# EAGLE design ExtBoard (EAGLE 6.5.0)
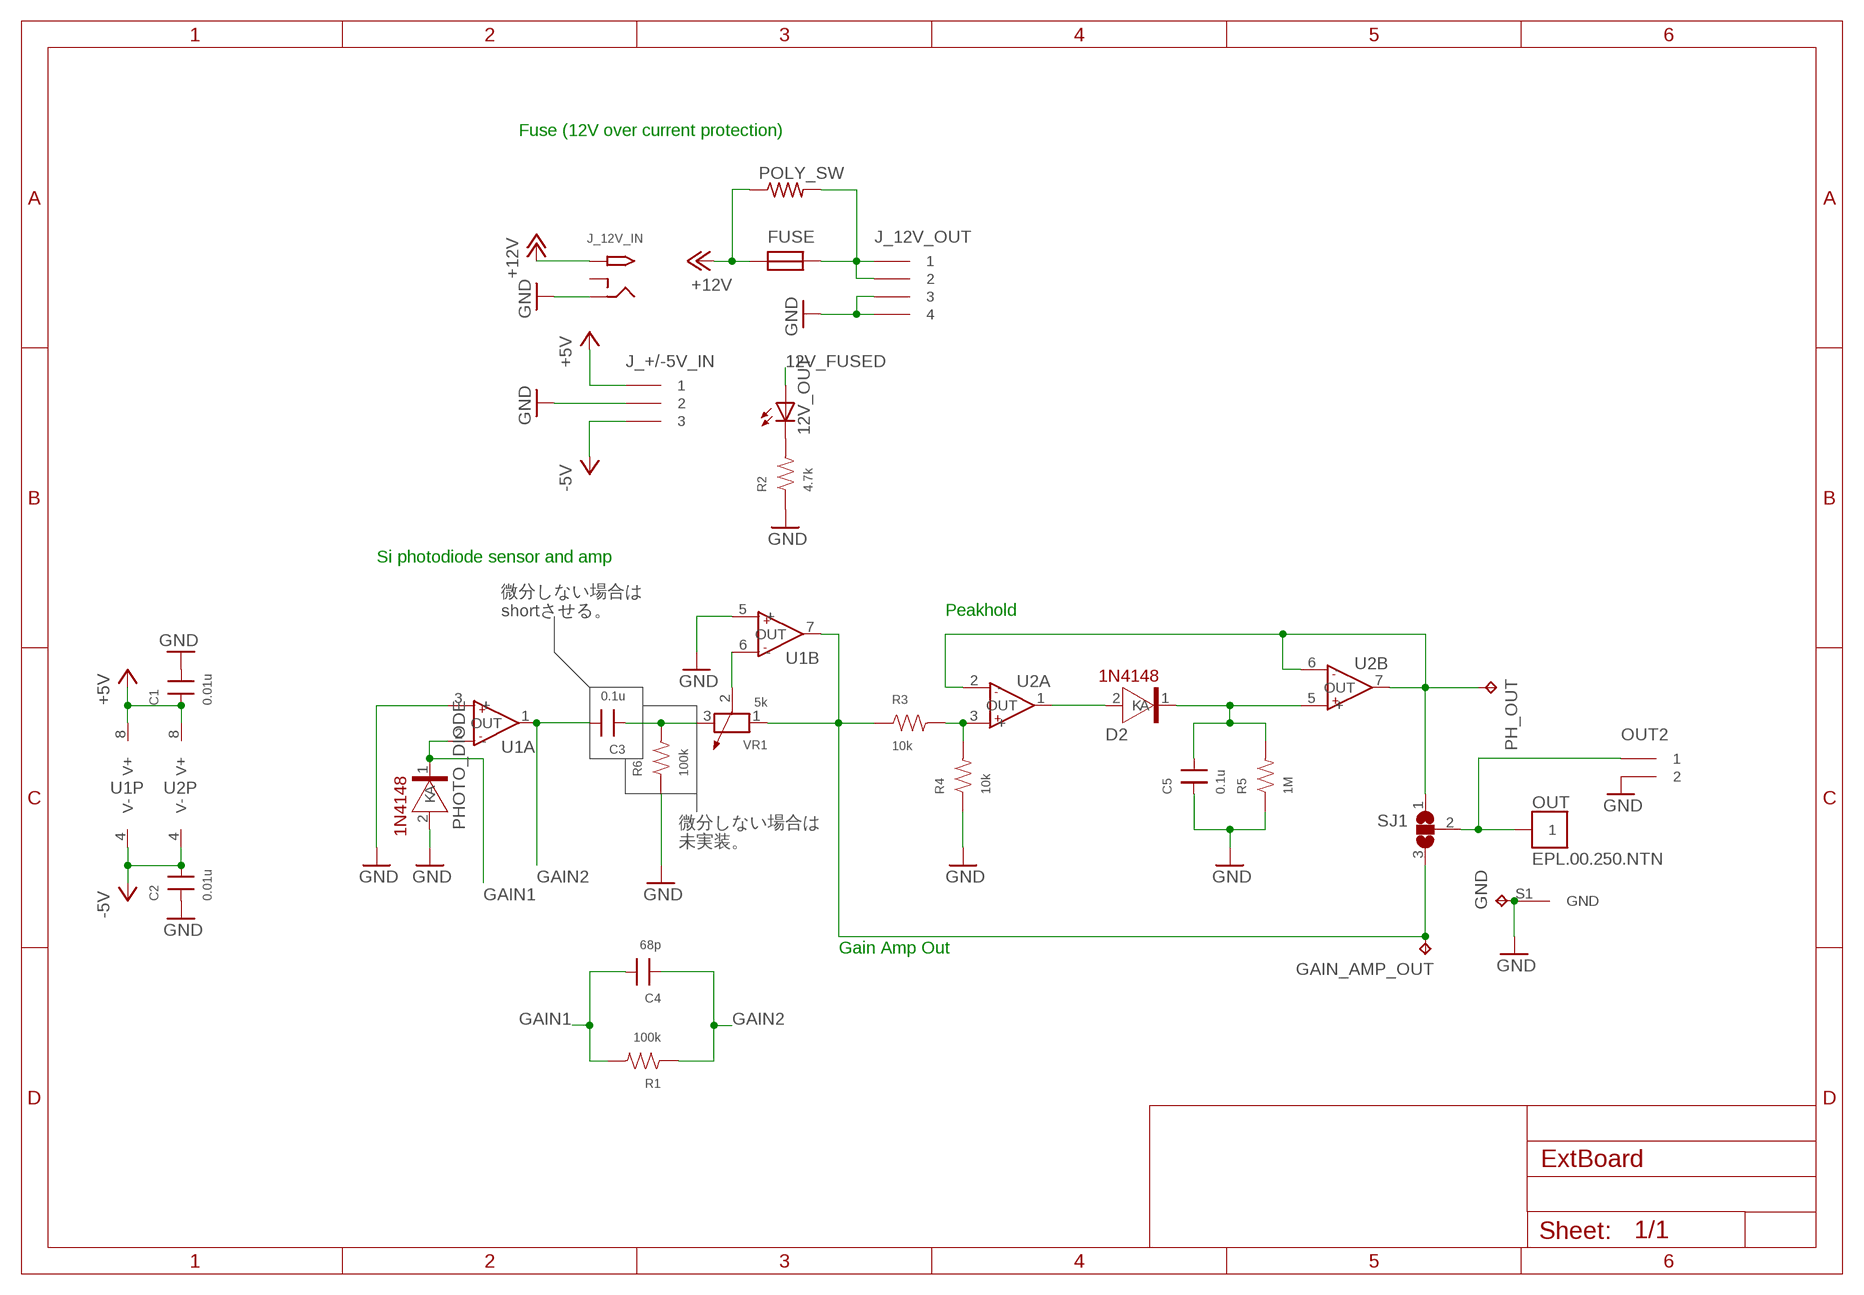
[diagram p0: schematic, sheet 1]

## Parts
12V_OUT  LED_1608  [LED_1608]
C1  0.01u  C226-3216  [3216]
C2  0.01u  C226-3216  [3216]
C3  0.1u  C226-3216  [3216]
C4  68p  C226-3216  [3216]
C5  0.1u  C226-3216  [3216]
D2  1N4148  [4020-2P]
FUSE  FUSE_LITTLEFUSE_649  [LITTLEFUSE_649]
GAIN_AMP_OUT  TPPAD1-13  [P1-13]
GND  TPPAD1-13  [P1-13]
J_12V_IN  2.1MMJACKTHM  [PJ-102A]
J_12V_OUT  IL-4P-S3EN2  [IL-4P-S3EN2]
J_+/-5V_IN  IL-3P-S3EN2  [IL-3P-S3EN2]
OUT  EPL.00.250.NTN  [EPL.00.250.NTN]
OUT2  IL-2P-S3EN2  [IL-2P-S3EN2]
PH_OUT  TPPAD1-13  [P1-13]
PHOTO_DIODE  1N4148  [4020-2P]
POLY_SW  R-US_0207/10  [0207/10]
R1  100k  R2012  [2012]
R2  4.7k  R2012  [2012]
R3  10k  R2012  [2012]
R4  10k  R2012  [2012]
R5  1M  R2012  [2012]
R6  100k  R2012  [2012]
SJ1  SJ2WW  [SJ_2W]
U1  LM6172SOIC(D)8  [SOP8]
U2  LM6172SOIC(D)8  [SOP8]
VR1  5k  DIP-TRIMMER-10K-10%-1/2W(3P-9.7X5.0X9.80MM)  [ADJRP3-9.70XW5.0X9.80MM]

## Nets
12V_FUSED [power]: 12V_OUT.P$1(A) FUSE.P$2 J_12V_OUT.P$1 J_12V_OUT.P$2 POLY_SW.2
+5V: C1.1 J_+/-5V_IN.P$1 U1.8(P:V+) U2.8(P:V+)
+12V [power]: FUSE.P$1 J_12V_IN.TIP POLY_SW.1
-5V: C2.2 J_+/-5V_IN.P$3 U1.4(P:V-) U2.4(P:V-)
GAIN1: C4.2 PHOTO_DIODE.1(K) R1.2 U1.2(A:-)
GAIN2: C3.2 C4.1 R1.1 U1.1(A:OUT)
GAIN_AMP_OUT: GAIN_AMP_OUT.TP R3.1 SJ1.3 U1.7(B:OUT) VR1.1
GND [power]: C1.2 C2.1 C5.1 GND.TP J_12V_IN.RING J_12V_OUT.P$3 J_12V_OUT.P$4 J_+/-5V_IN.P$2 OUT2.P$2 OUT.S1(GND) PHOTO_DIODE.2(A) R2.1 R4.1 R5.1 R6.1 U1.3(A:+) U1.5(B:+)
N$1: OUT2.P$1 OUT.1 SJ1.2
N$3: U1.6(B:-) VR1.2
N$4: C5.2 D2.1(K) R5.2 U2.5(B:+)
N$5: R3.2 R4.2 U2.3(A:+)
N$6: D2.2(A) U2.1(A:OUT)
N$10: C3.1 R6.2 VR1.3
N$12: 12V_OUT.P$2(C) R2.2
PH_OUT: PH_OUT.TP SJ1.1 U2.2(A:-) U2.6(B:-) U2.7(B:OUT)
Unconnected: J_12V_IN.RING_SW

## Notes on the sheet
- Fuse (12V over current protection)
- Si photodiode sensor and amp
- 微分しない場合は
  shortさせる。
- Peakhold
- 微分しない場合は
  未実装。
- Gain Amp Out

## Library data of the parts
12V_OUT = Aardvark:LED_1608: SMD LED datasheet <http://docs-asia.electrocomponents.com/webdocs/1020/0900766b81020b31.pdf> -------------------------- 色: V 1608 SML-310VTT86 (Vf=2.0V I_F=20mA) RS: 700-7926 <http://jp.rs-online.com/web/p/visible-leds/7007926/> 15円/個 20個単位 -------------------------- 色: 黄色 SML-311WTT86 (Vf=1.8 I_F=2mA) RS: 752-6789 <http://jp.rs-online.com/web/p/visible-leds/7526789/> 11.5円/個 10個単位
C1-C5 = Aardvark:C226-3216: MURATA 22uF 25WV AKIDUKI P-06038 GRM31CB31E226KE15
D2 PHOTO_DIODE = Aardvark:1N4148: VISHAY 1N4148 1N4448 100V 200mA http://www.nxp.com/documents/data_sheet/1N4148_1N4448.pdf
FUSE = Aardvark:FUSE_LITTLEFUSE_649: LittleFuse 649 For 5x20mm fuse RS: 787-4164 Datasheet <http://docs-asia.electrocomponents.com/webdocs/128f/0900766b8128f4b9.pdf>
GAIN_AMP_OUT GND PH_OUT = Aardvark:TP: Test pad
J_12V_IN = Aardvark:2.1MMJACK: 2.1mm x 5.5mm THM DC jack with internal switch. Digikey part #PJ-102A, 4UCON part #05537 2.1mm x 5.5mm SMT DC jack with internal switch. Digikey part #PJ-002A-SMT, 4UCON part #03267 By microbuilder.eu & adafruit.com
J_12V_OUT = Aardvark:IL-4P-S3EN2: JAE 4pin connector (used by Shimafuji FPGA boards) http://jae-connectors.com/jp/pdf_download_exec.cfm?param=SJ015900.pdf
J_+/-5V_IN = Aardvark:IL-3P-S3EN2: JAE 3pin connector (used by Shimafuji FPGA boards) http://jae-connectors.com/jp/pdf_download_exec.cfm?param=SJ015900.pdf
OUT = Aardvark:EPL.00.250.NTN: LEMO Connector Elbow receptacle for printed circuit Source: http://intra.lemo.ch/catalog/ROW/UK_English/00and01Coaxial_en.pdf RS: Right angle: http://jp.rs-online.com/web/p/coaxial-plugs-sockets/1248635/ Straight1: http://jp.rs-online.com/web/p/coaxial-plugs-sockets/1243371/ Straight2: http://jp.rs-online.com/web/p/coaxial-plugs-sockets/1248629/; MPN: EPL.00.250.NTN; OC_FARNELL: 3817866; OC_NEWARK: 25R7486; PACKAGE: Through Hole; SUPPLIER: LEMO
OUT2 = Aardvark:IL-2P-S3EN2: JAE 2pin connector (used by Shimafuji FPGA boards) http://jae-connectors.com/jp/pdf_download_exec.cfm?param=SJ015900.pdf
POLY_SW = rcl:R-US_: RESISTOR, American symbol
R1-R6 = Aardvark:R2012: Surface Mount 2012 Type Registor
SJ1 = Aardvark:SJ2W: SMD solder JUMPER
U1 U2 = Aardvark:LM6172: TEXAS INSTRUMENTS Dual High Speed, Low Power, Low Distortion, Voltage Feedback Amplifier LM6172 <http://www.ti.com/lit/ds/symlink/lm6172.pdf>
VR1 = Aardvark:DIP-TRIMMER-10K-10%-1/2W(3P-9.7X5.0X9.80MM): T93YA502KT20 Datasheet <http://docs-asia.electrocomponents.com/webdocs/0ed9/0900766b80ed9ad6.pdf> RS Website 788-5079 <http://jp.rs-online.com/web/p/trimmer-resistors/7885079/>; MPN: T93YA103KT20

## Net classes
1 power: width 0.508 mm, clearance 0.254 mm

## Board
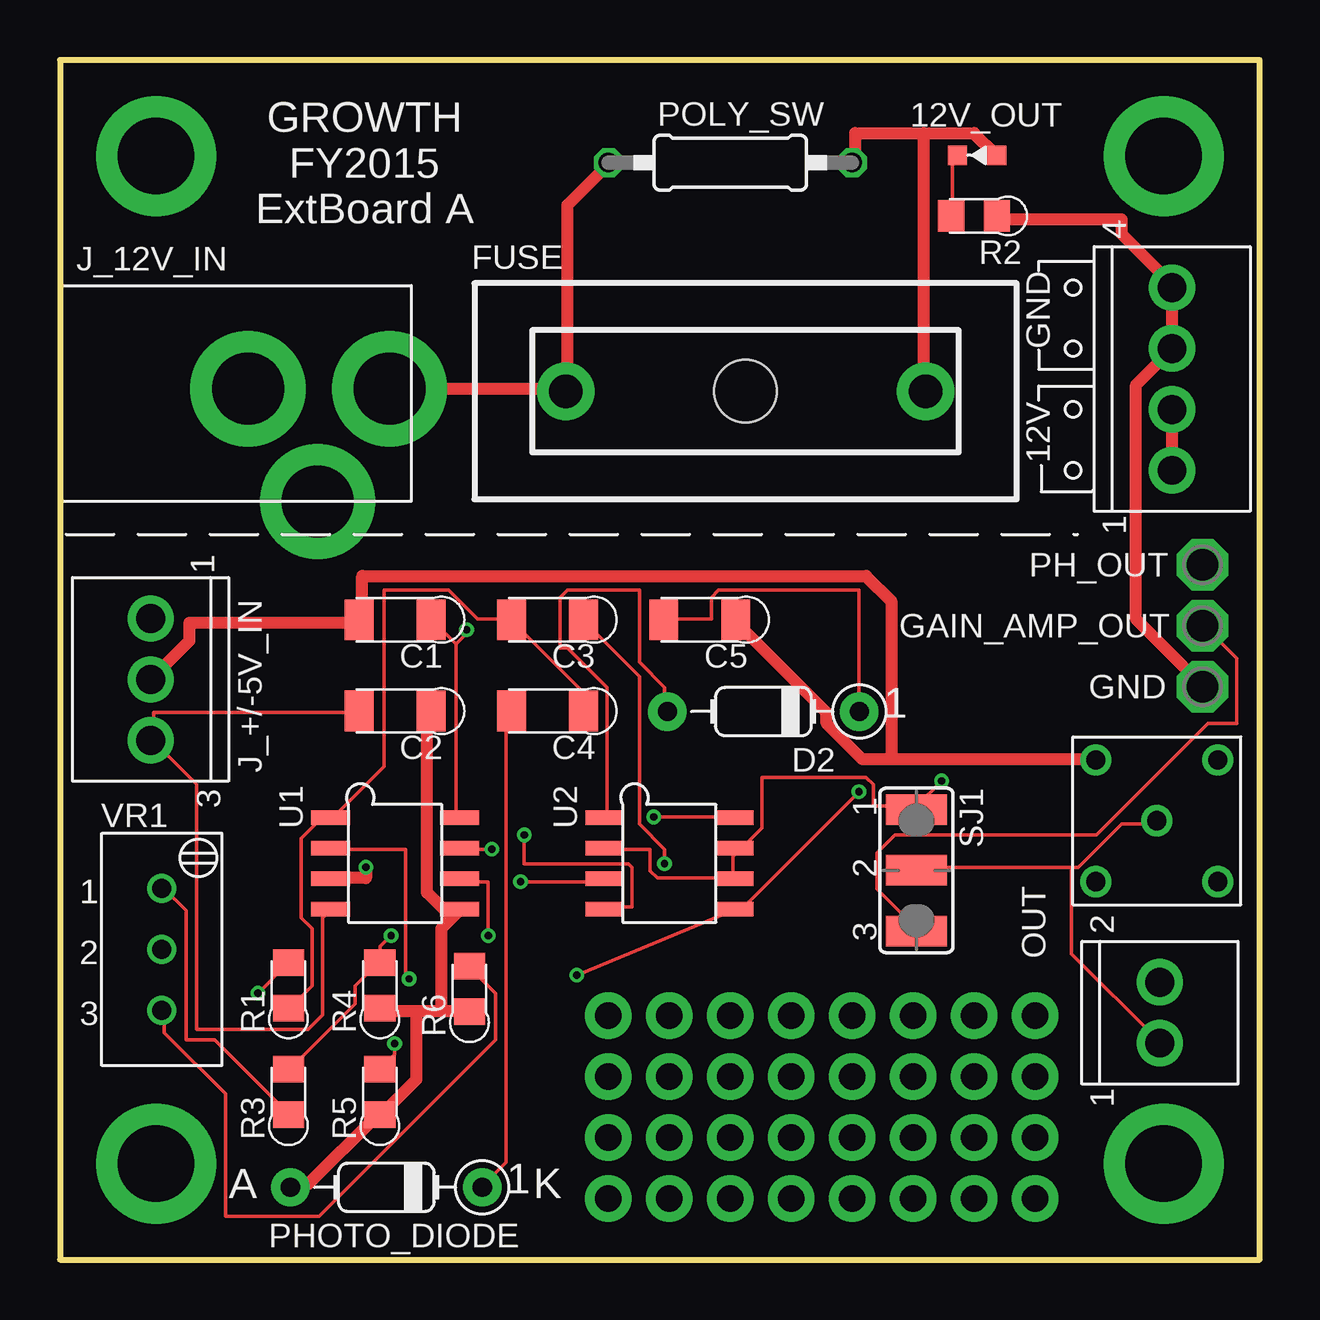
[diagram p1: board, top side]
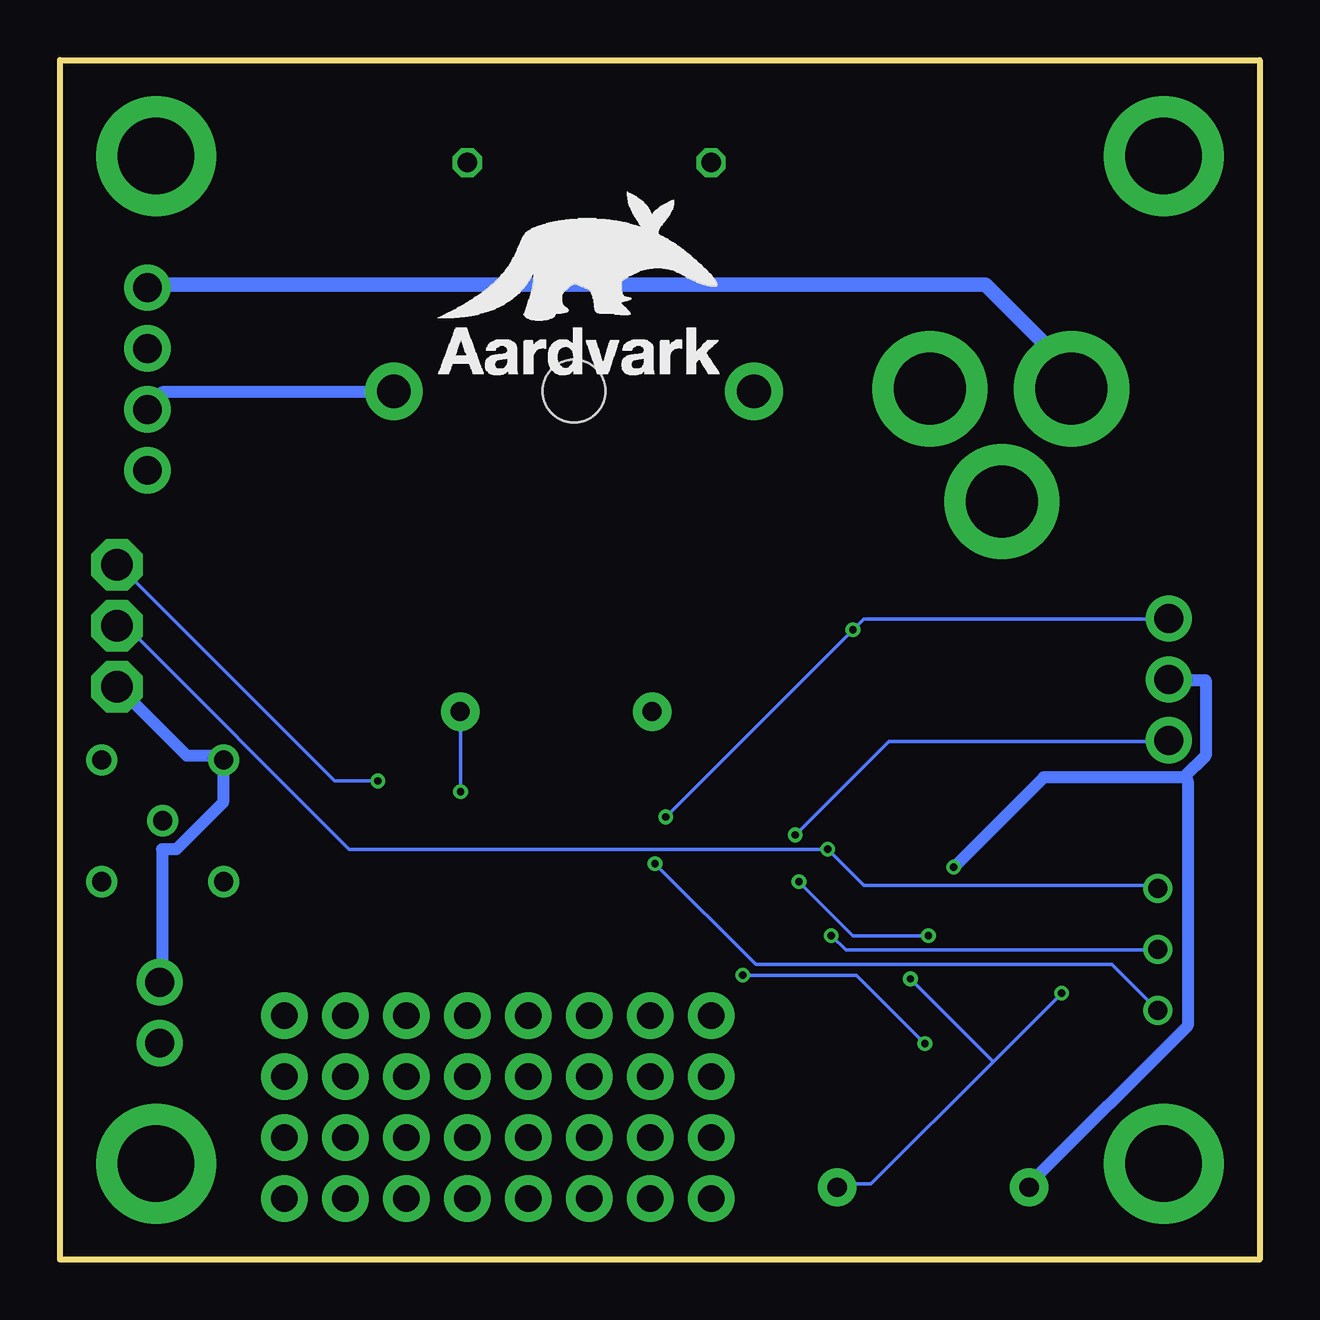
[diagram p2: board, bottom side, seen from below]

Size 50 x 50 mm. Coordinates in mm from the lower left corner, seen from the top.
Outline: 0,0 50,0 50,50 0,50 0,0
Copper layers (1*16): Top 0.035mm / dielectric 1.6mm / Bottom 0.035mm
Design rules "Elecrow_2-layer_PCB_eagle_rule": minimum track width 6mil, minimum drill 12mil, track to track 8mil, track to pad 8mil, pad to pad 8mil, via to via 8mil, smd to smd 0mil, copper to edge 20mil, drill to drill 10mil, minimum pad ring 6mil, minimum via ring 6mil, stop-mask expansion 0mil, vias tented up to drill 100mil, thermal gap 10mil

### Footprints (pad centres in the part's own frame; a part is rotated, then mirrored left to right if it is on the bottom)
LED_1608 = smd 0.8 x 0.8: P$1 0,0.825; P$2 0,-0.825
3216 = smd 1.2 x 1.7: 1 -1.5,0; 2 1.5,0
4020-2P = drill 0.8 pad 1.6: 1 -4,0; 2 4,0
LITTLEFUSE_649 = drill 1.4 pad 2.4: P$1 -7.5,0; P$2 7.5,0 | hole 2.6: 0,0
P1-13 = drill 1.321 pad 2.159 octagon: TP 0,0
PJ-102A = drill 3 pad 4.8: RING 0.1,-3.39; RING_SW -4.6,-6.29; TIP 0.1,-9.29
IL-4P-S3EN2 = drill 1.2 pad 1.93: P$1 -3.81,0; P$2 -1.27,0; P$3 1.27,0; P$4 3.81,0
IL-3P-S3EN2 = drill 1.2 pad 1.93: P$1 -2.54,0; P$2 0,0; P$3 2.54,0
EPL.00.250.NTN = drill 0.8 pad 1.3: 1 0,0; S1 -2.54,2.54; S2 -2.54,-2.54; S3 2.54,-2.54; S4 2.54,2.54
IL-2P-S3EN2 = drill 1.2 pad 1.93: P$1 -2.54,0; P$2 0,0
0207/10 = drill 0.813 octagon: 1 -5.08,0; 2 5.08,0
2012 = smd 1.1 x 1.3: 1 -0.95,0; 2 0.95,0
SJ_2W = smd 1.27 x 2.54: 1 -2.54,0; 2 0,0; 3 2.54,0
SOP8 = smd 0.6 x 1.62: 1 -1.905,-2.694; 2 -0.635,-2.694; 3 0.635,-2.694; 4 1.905,-2.694; 5 1.905,2.694; 6 0.635,2.694; 7 -0.635,2.694; 8 -1.905,2.694
ADJRP3-9.70XW5.0X9.80MM = drill 0.8: 1 0,2.54; 2 0,0; 3 0,-2.54

### Placement (x,y rotation side)
12V_OUT  38.23,46.02 270 top
C1  13.97,26.67 180 top
C2  13.97,22.86 180 top
C3  20.32,26.67 180 top
C4  20.32,22.86 180 top
C5  26.67,26.67 180 top
D2  29.32,22.84 180 top
E$1  [AARDVARK_LOGO]  34.29,36.83 0 bottom
FUSE  28.57,36.2 0 top
GAIN_AMP_OUT  47.62,26.42 0 top
GND  47.62,23.88 0 top
J_12V_IN  4.45,36.2 90 top
J_12V_OUT  46.35,36.7 90 top
J_+/-5V_IN  3.78,24.18 270 top
OUT  45.72,18.29 0 top
OUT2  45.85,11.56 90 top
PH_OUT  47.62,28.96 0 top
PHOTO_DIODE  13.6,3.01 180 top
POLY_SW  27.94,45.72 0 top
R1  9.53,11.43 90 top
R2  38.1,43.5 180 top
R3  9.53,6.99 90 top
R4  13.34,11.43 90 top
R5  13.34,6.99 90 top
R6  17.07,11.28 90 top
SJ1  35.7,16.22 270 top
U1  13.97,16.51 270 top
U2  25.4,16.51 270 top
VR1  4.25,12.93 0 top

### Tracks (layer width: path | path; a pad name or v marks a point on that pad's centre or on a via)
12V_FUSED
  Top 0.508: J_12V_OUT.P$1 46.35,33 46.35,35.4 J_12V_OUT.P$2 | 36,46.95 33.15,46.95 33.15,45.75 POLY_SW.2 | 36,46.95 38.1,46.95 39,46.05 12V_OUT.P$1 | 36,46.95 36,36.3 FUSE.P$2
  Bottom 0.508: J_12V_OUT.P$2 46.35,35.55 45.75,36.15 36.15,36.15 FUSE.P$2
+5V  (via drill 0.3)
  Top 0.152: 16.5,25.65 16.5,18.6 16.65,18.45 U1.8 | 16.5,25.65 15.6,26.55 C1.1 | v24.75,18.45 28.05,18.45 U2.8 | 16.5,25.65 16.95,26.1 v16.95,26.25
  Bottom 0.152: v24.75,18.45 v16.95,26.25 16.5,26.7 3.9,26.7 J_+/-5V_IN.P$1
+12V
  Top 0.508: POLY_SW.1 22.8,45.6 21.15,43.95 21.15,36.3 FUSE.P$1 20.85,36.3 13.8,36.3 J_12V_IN.TIP
-5V  (via drill 0.3)
  Top 0.152: U1.4 11.25,14.55 10.95,14.25 10.95,10.2 10.35,9.6 5.7,9.6 5.7,19.8 3.9,21.6 J_+/-5V_IN.P$3 3.9,21.75 3.9,22.8 12.45,22.8 C2.2 | v19.35,17.7 19.35,16.5 23.7,16.5 23.85,16.35 23.85,14.7 22.8,14.7 U2.4
  Bottom 0.152: v19.35,17.7 15.45,21.6 3.9,21.6 J_+/-5V_IN.P$3
GAIN1  (via drill 0.3)
  Top 0.152: v8.25,11.1 9.45,12.3 R1.2 | v14.55,11.7 14.4,11.85 14.4,17.1 11.4,17.1 U1.2 | C4.2 18.75,22.8 18.6,22.65 18.6,4.05 17.7,3.15 PHOTO_DIODE.1
  Bottom 0.152: 11.1,8.25 16.2,3.15 17.55,3.15 PHOTO_DIODE.1 | 11.1,8.25 v8.25,11.1 | 11.1,8.25 v14.55,11.7
GAIN2
  Top 0.152: C4.1 21.75,22.95 21.75,23.7 18.9,26.55 C3.2 18.75,26.7 17.4,26.7 16.2,27.9 13.5,27.9 13.5,20.55 11.4,18.45 U1.1 11.25,18.3 10.8,18.3 10.05,17.55 10.05,14.25 10.5,13.8 10.5,11.4 9.6,10.5 R1.1
GAIN_AMP_OUT  (via drill 0.3)
  Top 0.152: R3.1 9.45,6.15 6.45,9.15 5.25,9.15 5.25,14.55 4.35,15.45 VR1.1 | v18,17.1 16.8,17.1 U1.7 | SJ1.3 35.7,13.8 34.05,15.45 34.05,16.95 34.8,17.7 43.2,17.7 47.85,22.35 49.05,22.35 49.05,25.05 47.7,26.4 GAIN_AMP_OUT.TP
  Bottom 0.152: VR1.1 4.35,15.6 16.5,15.6 v18,17.1 37.95,17.1 47.25,26.4 47.55,26.4 GAIN_AMP_OUT.TP
GND  (via drill 0.3)
  Top 0.508: R2.1 39.15,43.35 44.25,43.35 44.25,42.75 46.35,40.65 J_12V_OUT.P$4 46.35,40.35 46.35,38.1 J_12V_OUT.P$3 46.2,37.8 44.85,36.45 44.85,26.7 47.55,24 GND.TP | 34.65,20.85 43.05,20.85 OUT.S1 | 34.65,20.85 33.45,20.85 31.95,22.35 31.95,22.8 28.2,26.55 C5.1 | PHOTO_DIODE.2 9.6,3.15 10.35,3.15 13.2,6 R5.1 13.5,6.15 14.85,7.5 14.85,10.35 | 15.9,10.35 16.95,10.35 R6.1 | 15.9,10.35 14.85,10.35 | 14.85,10.35 13.35,10.35 R4.1 | 15.9,10.35 15.9,13.8 16.65,14.55 U1.5 16.2,14.4 15.3,15.3 15.3,22.65 15.45,22.8 C2.1 | v12.75,16.35 12.75,15.9 11.4,15.9 U1.3 | J_+/-5V_IN.P$2 5.4,25.8 5.4,26.55 12.45,26.55 C1.2 12.6,26.85 12.6,28.5 33.6,28.5 34.65,27.45 34.65,20.85
  Bottom 0.508: OUT2.P$2 45.75,11.7 45.75,17.1 45.15,17.1 43.2,19.05 43.2,20.7 OUT.S1 43.35,21 44.7,21 47.55,23.85 GND.TP | v12.75,16.35 9,20.1 3.15,20.1 | 3.15,20.1 2.25,21 2.25,24.15 3.75,24.15 J_+/-5V_IN.P$2 | PHOTO_DIODE.2 9.6,3.15 3,9.75 3,19.95 3.15,20.1
  Bottom 0.61: J_12V_IN.RING 7.83,37.05 11.43,40.64 46.23,40.64 J_12V_OUT.P$4
N$1
  Top 0.152: 42.15,16.35 42.45,16.35 44.25,18.15 45.6,18.15 OUT.1 | 42.15,16.35 35.7,16.35 SJ1.2 | 42.15,16.35 42.15,12.75 45.75,9.15 OUT2.P$1
N$2  (via drill 1.1 pad 1.93)
  other vias: 22.86,2.54
N$3  (via drill 0.3)
  Top 0.152: v17.85,13.5 17.85,15.75 16.8,15.75 U1.6
  Bottom 0.152: v17.85,13.5 17.25,12.9 4.35,12.9 VR1.2
N$4  (via drill 0.3)
  Top 0.152: C5.2 25.2,26.7 27.15,26.7 27.15,27.6 27.45,27.9 33.3,27.9 33.3,22.95 D2.1 | R5.2 13.95,8.55 v13.95,9 | v21.54,11.85 28.05,14.55 U2.5 28.2,14.7 28.5,14.7 v33.3,19.5
  Bottom 0.152: v13.95,9 16.8,11.85 v21.54,11.85 | v33.3,19.5 33.3,22.8 D2.1
N$5  (via drill 0.3)
  Top 0.152: R3.2 9.6,7.95 12.3,10.65 12.3,11.4 13.2,12.3 R4.2 13.35,12.45 13.35,13.05 v13.8,13.5 | v19.2,15.75 22.65,15.75 U2.3
  Bottom 0.152: v19.2,15.75 16.95,13.5 v13.8,13.5
N$6
  Top 0.152: U2.1 22.8,18.45 22.8,23.85 21.15,25.5 20.85,25.5 20.85,27.6 21.15,27.9 24.15,27.9 24.15,24.9 25.2,23.85 25.2,22.95 D2.2
N$7  (via drill 3.2 pad 5)
  other vias: 4,4
N$8  (via drill 3.2 pad 5)
  other vias: 46,4
N$9  (via drill 3.2 pad 5)
  other vias: 4,46
N$10  (via drill 0.3)
  Top 0.152: R6.2 17.1,12.15 18.15,11.1 18.15,9.15 10.8,1.8 6.9,1.8 6.9,6.9 4.35,9.45 4.35,10.35 VR1.3 | v25.2,16.5 25.2,17.1 24.15,18.15 24.15,24.3 21.9,26.55 C3.1
  Bottom 0.152: v25.2,16.5 21,12.3 6.15,12.3 4.35,10.5 VR1.3
N$11  (via drill 3.2 pad 5)
  other vias: 46,46
N$12
  Top 0.152: 12V_OUT.P$2 37.35,45.9 37.2,45.75 37.2,43.5 R2.2
N$13  (via drill 1.1 pad 1.93)
  other vias: 25.4,2.54
N$14  (via drill 1.1 pad 1.93)
  other vias: 27.94,2.54
N$15  (via drill 1.1 pad 1.93)
  other vias: 30.48,2.54
N$16  (via drill 1.1 pad 1.93)
  other vias: 33.02,2.54
N$17  (via drill 1.1 pad 1.93)
  other vias: 35.56,2.54
N$18  (via drill 1.1 pad 1.93)
  other vias: 38.1,2.54
N$19  (via drill 1.1 pad 1.93)
  other vias: 40.64,2.54
N$20  (via drill 1.1 pad 1.93)
  other vias: 22.86,5.08
N$21  (via drill 1.1 pad 1.93)
  other vias: 25.4,5.08
N$22  (via drill 1.1 pad 1.93)
  other vias: 27.94,5.08
N$23  (via drill 1.1 pad 1.93)
  other vias: 30.48,5.08
N$24  (via drill 1.1 pad 1.93)
  other vias: 33.02,5.08
N$25  (via drill 1.1 pad 1.93)
  other vias: 35.56,5.08
N$26  (via drill 1.1 pad 1.93)
  other vias: 38.1,5.08
N$27  (via drill 1.1 pad 1.93)
  other vias: 40.64,5.08
N$28  (via drill 1.1 pad 1.93)
  other vias: 40.64,7.62
N$29  (via drill 1.1 pad 1.93)
  other vias: 38.1,7.62
N$30  (via drill 1.1 pad 1.93)
  other vias: 35.56,7.62
N$31  (via drill 1.1 pad 1.93)
  other vias: 33.02,7.62
N$32  (via drill 1.1 pad 1.93)
  other vias: 30.48,7.62
N$33  (via drill 1.1 pad 1.93)
  other vias: 27.94,7.62
N$34  (via drill 1.1 pad 1.93)
  other vias: 25.4,7.62
N$35  (via drill 1.1 pad 1.93)
  other vias: 22.86,7.62
N$36  (via drill 1.1 pad 1.93)
  other vias: 22.86,10.16
N$37  (via drill 1.1 pad 1.93)
  other vias: 27.94,10.16
N$38  (via drill 1.1 pad 1.93)
  other vias: 25.4,10.16
N$39  (via drill 1.1 pad 1.93)
  other vias: 30.48,10.16
N$40  (via drill 1.1 pad 1.93)
  other vias: 33.02,10.16
N$41  (via drill 1.1 pad 1.93)
  other vias: 35.56,10.16
N$42  (via drill 1.1 pad 1.93)
  other vias: 38.1,10.16
N$43  (via drill 1.1 pad 1.93)
  other vias: 40.64,10.16
PH_OUT  (via drill 0.3)
  Top 0.152: 28.05,16.8 28.05,17.1 U2.7 | 28.05,16.8 28.05,15.9 | 28.05,15.9 24.9,15.9 24.6,16.2 24.6,17.1 22.8,17.1 U2.2 | 28.05,15.9 U2.6 | 35.7,18.9 33.9,18.9 33.9,19.8 33.6,20.1 29.25,20.1 29.25,18 28.05,16.8 | 35.7,18.9 v36.75,19.95 | 35.7,18.9 SJ1.1
  Bottom 0.152: v36.75,19.95 38.55,19.95 47.55,28.95 PH_OUT.TP

### Text on the board
tPlace: GROWTH / FY2015 / ExtBoard A | A | K
tNames: GND | 12V